# EAGLE design D1MSHO (EAGLE 9.0.1)
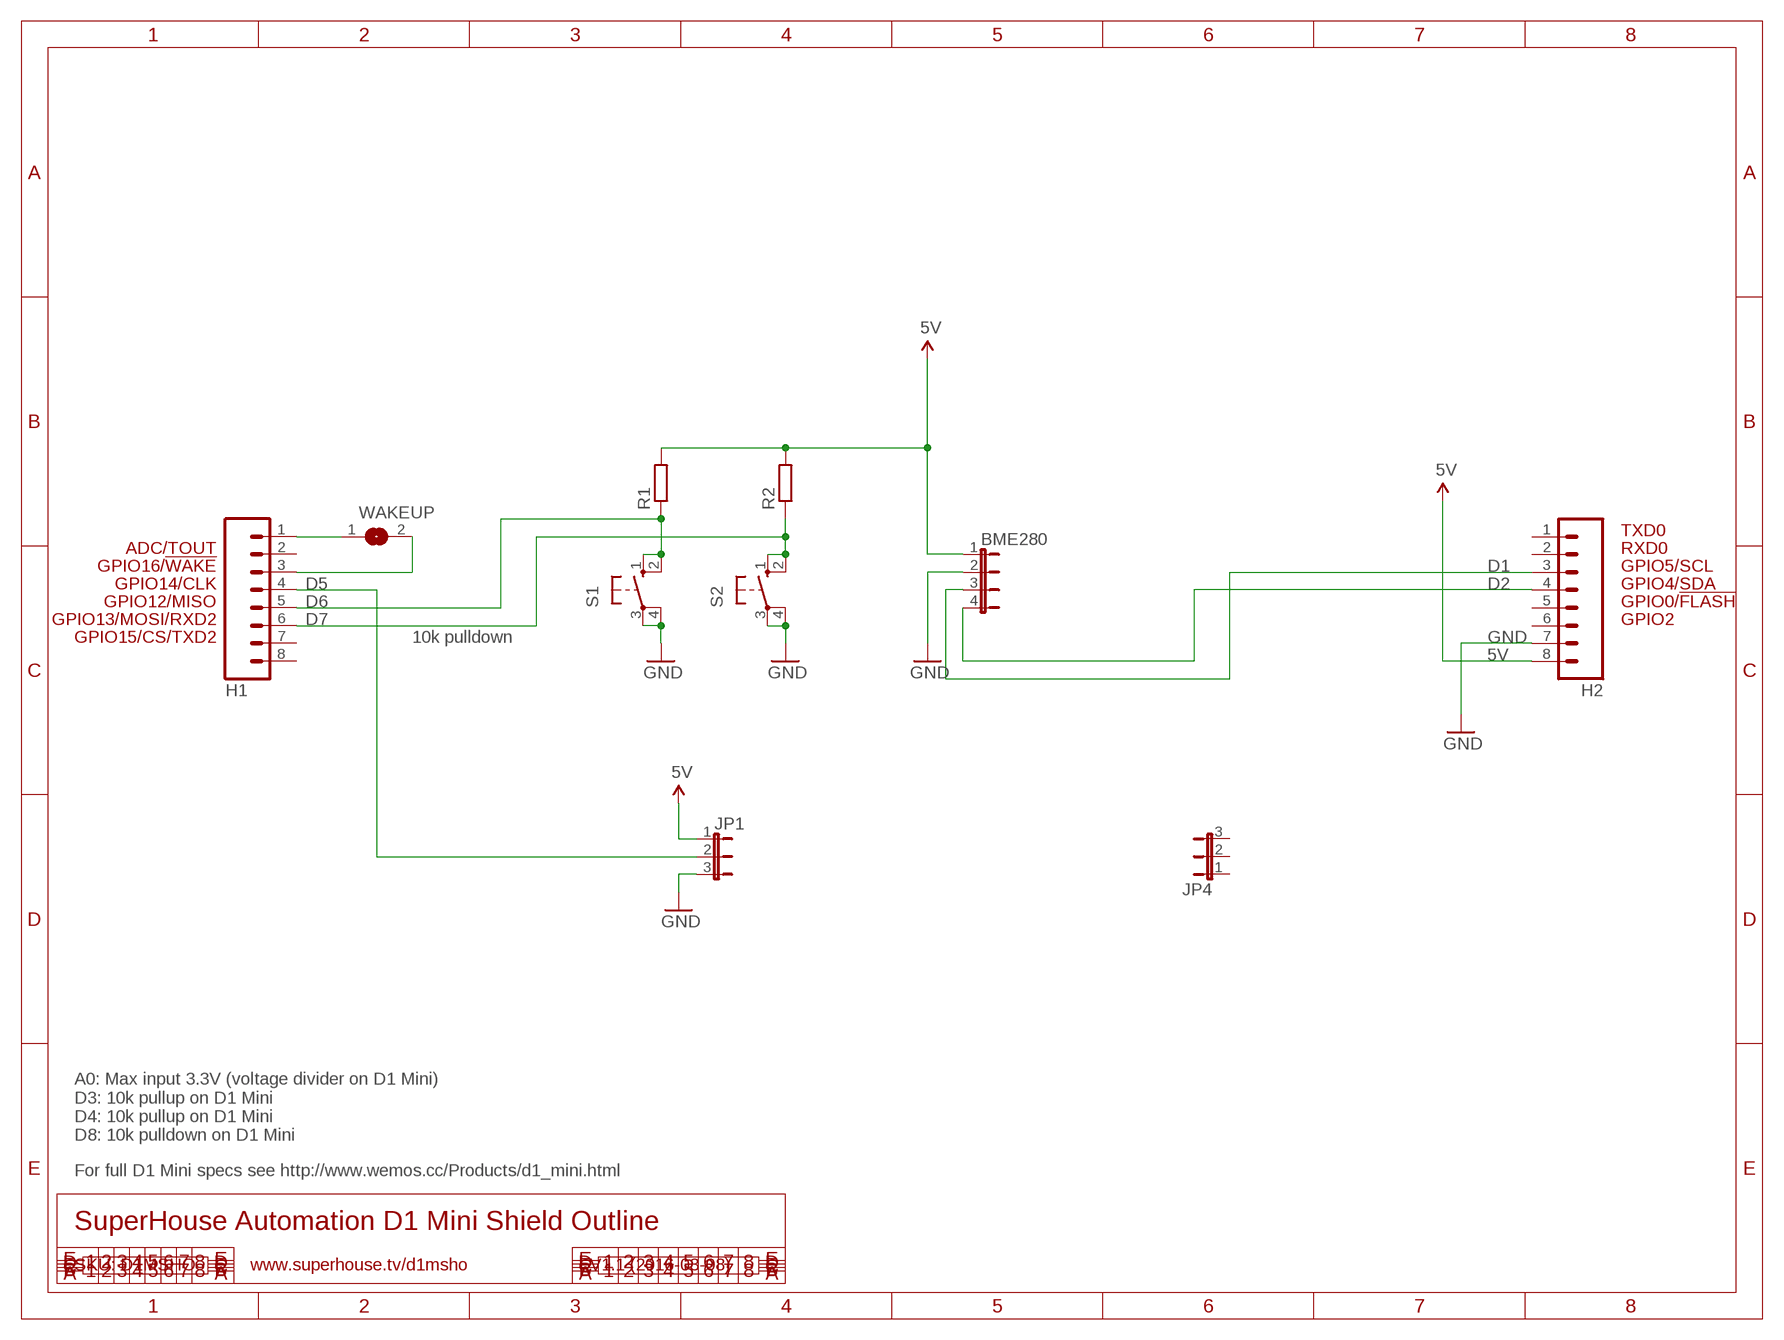
[diagram p0: schematic, sheet 1]

## Parts
BME280  JP4E  [JP4]
H1  M08  [1X08]
H2  M08  [1X08]
JP1  JP2E  [JP2]
JP4  JP2E  [JP2]
R1  R-EU_R0805  [R0805]
R2  R-EU_R0805  [R0805]
S1  10-XX  [B3F-10XX]
S2  10-XX  [B3F-10XX]
WAKEUP  SJ  [SJ]

## Nets
5V: BME280.1 H2.8 JP1.1 R1.2 R2.2
D1: BME280.3 H2.3
D2: BME280.4 H2.4
D5: H1.4 JP1.2
D6: H1.5 R1.1 S1.1(S) S1.2(S1)
D7: H1.6 R2.1 S2.1(S) S2.2(S1)
GND: BME280.2 H2.7 JP1.3 S1.3(P) S1.4(P1) S2.3(P) S2.4(P1)
N$1: H1.1 WAKEUP.1
N$2: H1.3 WAKEUP.2
Unconnected: H1.2 H1.7 H1.8 H2.1 H2.2 H2.5 H2.6 JP4.1 JP4.2 JP4.3

## Notes on the sheet
- TXD0
- ADC/TOUT | RXD0
- GPIO16/!WAKE | GPIO5/SCL
- GPIO14/CLK | GPIO4/SDA
- GPIO12/MISO | GPIO0/!FLASH
- GPIO13/MOSI/RXD2 | GPIO2
- GPIO15/CS/TXD2 | 10k pulldown
- A0: Max input 3.3V (voltage divider on D1 Mini)
  D3: 10k pullup on D1 Mini
  D4: 10k pullup on D1 Mini
  D8: 10k pulldown on D1 Mini
- For full D1 Mini specs see http://www.wemos.cc/Products/d1_mini.html
- SuperHouse Automation D1 Mini Shield Outline
- SKU: D1MSHO | www.superhouse.tv/d1msho | V1.1 (2016-03-08)

## Library data of the parts
BME280 = jumper:JP4E: JUMPER
H1 H2 = freetronics-original:M08: Header 8 Standard 8-pin 0.1" header. Use with straight break away headers (SKU : PRT-00116), right angle break away headers (PRT-00553), swiss pins (PRT-00743), machine pins (PRT-00117), and female headers (PRT-00115).
JP1 JP4 = jumper:JP2E: JUMPER
R1 R2 = rcl:R-EU_: RESISTOR, European symbol; SPICEPREFIX: R
S1 S2 = switch-omron:10-XX: OMRON SWITCH; MPN: B3F-1000; OC_FARNELL: 176432; OC_NEWARK: 36M3542
WAKEUP = jumper:SJ: SMD solder JUMPER

## Net classes
0 default: width 0.203 mm, drill 0.356 mm, clearance 0.152 mm
1 power: width 0.203 mm, clearance 0.152 mm

## Board
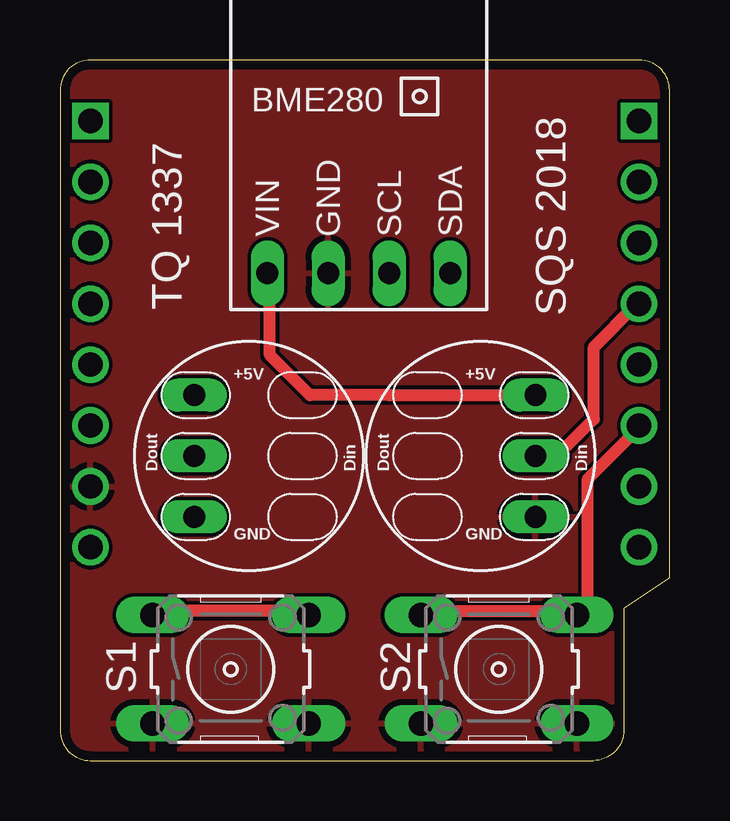
[diagram p1: board, top side]
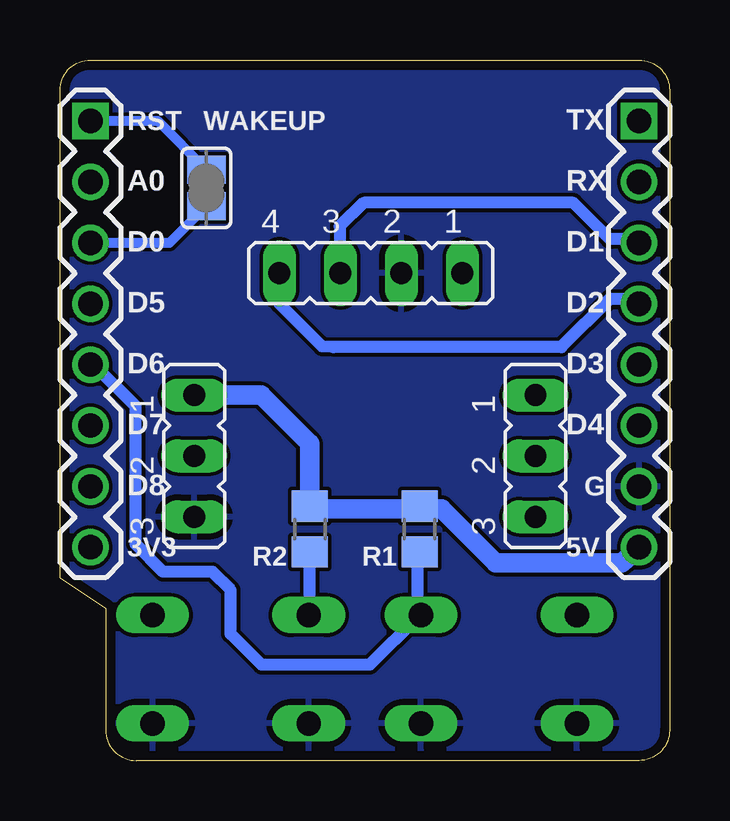
[diagram p2: board, bottom side, seen from below]

Size 25.4 x 29.21 mm. Coordinates in mm from the lower left corner, seen from the top.
Outline: 0,27.94 0,1.27 arc90 1.27,0 22.22,0 arc90 23.49,1.27 23.49,6.35 25.4,7.62 25.4,27.94 arc90 24.13,29.21 1.27,29.21 arc90 0,27.94
Copper layers (1*16): Top 0.035559375mm / dielectric 1.6mm / Bottom 0.035559375mm
Design rules "oshpark-2layer-tented": minimum track width 6mil, minimum drill 10mil, track to track 6mil, track to pad 6mil, pad to pad 6mil, via to via 6mil, smd to smd 6mil, copper to edge 15mil, drill to drill 6mil, minimum pad ring 5mil, minimum via ring 5mil, stop-mask expansion 2.5mil, vias tented up to drill 20mil, thermal gap 10mil

### Footprints (pad centres in the part's own frame; a part is rotated, then mirrored left to right if it is on the bottom)
JP4 = drill 0.914 long: 1 -3.81,0; 2 -1.27,0; 3 1.27,0; 4 3.81,0
1X08 = drill 1.016 square: 1 0,0 | drill 1.016: 2 2.54,0; 3 5.08,0; 4 7.62,0; 5 10.16,0; 6 12.7,0; 7 15.24,0; 8 17.78,0
JP2 = drill 0.914 long: 1 -2.54,0; 2 0,0; 3 2.54,0
R0805 = smd 1.3 x 1.5: 1 -0.95,0; 2 0.95,0
B3F-10XX = drill 1.016 long: 1 -3.251,2.261; 2 3.251,2.261; 3 -3.251,-2.261; 4 3.251,-2.261
SJ = smd 1.168 x 1.6: 1 -0.762,0; 2 0.762,0

### Placement (x,y rotation side)
BME280  12.45,20.32 180 bottom
H1  24.13,26.67 270 bottom
H2  1.27,26.67 270 bottom
JP1  19.81,12.7 270 bottom
JP4  5.59,12.7 270 bottom
R1  10.41,9.65 90 bottom
R2  14.99,9.65 90 bottom
S1  7.11,3.81 0 top
S2  18.29,3.81 0 top
U$2  [WS2812BBOARD]  7.87,12.7 0 top
U$4  [WS2812BBOARD]  17.53,12.7 0 top
WAKEUP  19.3,23.88 270 bottom

### Tracks (layer width: path | path; a pad name or v marks a point on that pad's centre or on a via)
5V
  Top 0.508: 13.75,15.25 13.72,15.24 | 13.72,15.24 10.41,15.24 8.75,16.91 8.75,20.21 BME280.1 | 13.72,15.24 JP1.1
  Bottom 0.203: 14.75,10.5 R2.2 | 19.75,15.25 JP1.1 | 10.25,10.5 R1.2
  Bottom 0.813: 14.75,10.5 10.5,10.5 R1.2 | R2.2 15,10.75 15,13.22 17.02,15.24 JP1.1 | 10.25,10.5 9.5,10.5 7.24,8.24 2,8.24 H2.8
D1
  Bottom 0.508: H2.3 1.5,21.75 2.5,21.75 4.01,23.26 12.73,23.26 13.75,22.28 13.75,20.35 BME280.3
D2
  Bottom 0.508: H2.4 1.5,19.25 2.5,19.25 4.51,17.24 14,17.24 14.48,17.27 16.25,19.04 16.25,20.25 16.26,20.26 BME280.4
D5
  Top 0.203: 24,19
  Top 0.508: 24,19 22.24,17.25 22.24,14.23 20.71,12.7 JP1.2 | 24,19 H1.4
D6
  Top 0.508: S1.1 4,6.25 10.25,6.25 S1.2
  Bottom 0.203: 10.5,8.5 R1.1 | 10.5,6.25 S1.2 10.5,6
  Bottom 0.508: 10.5,6.25 10.5,8.5 | 10.5,6 10.48,6 12.49,3.99 17,3.99 18.29,5.28 18.29,7.11 19.05,7.87 21.1,7.87 22.25,9.02 22.25,14.75 24,16.5 H1.5
D7
  Top 0.203: 21.5,6.25 S2.2
  Top 0.508: 21.5,6.25 15.25,6.25 S2.1 | H1.6 24,13.75 22,11.75 22,6.5 21.75,6.25 S2.2
  Bottom 0.203: 15,8.5 R2.1 | 15,6.25 S2.1
  Bottom 0.508: 15,6.25 15,8.5
GND
  pour Bottom: 0,27.94 arc-90 1.27,29.21 24.13,29.21 arc-90 25.4,27.94 25.4,7.62 23.49,6.35 23.49,1.27 arc-90 22.22,0 1.27,0 arc-90 0,1.27
  pour Top: 0,1.27 0,27.94 arc-90 1.27,29.21 24.13,29.21 arc-90 25.4,27.94 25.4,7.62 23.49,6.35 23.49,1.27 arc-90 22.22,0 1.27,0 arc-90
N$1
  Bottom 0.406: H1.1 21.34,26.67 WAKEUP.1
N$2
  Bottom 0.406: H1.3 20.83,21.59 WAKEUP.2

### Text on the board
tPlace: VIN | GND | SCL | SDA | TQ 1337 | SQS 2018
bPlace: TX | RST | RX | A0 | D1 | D0 | D2 | D5 | D3 | D6 | D4 | D7 | G | D8 | 5V | 3V3